# EAGLE schematic carrier (EAGLE 6.1)
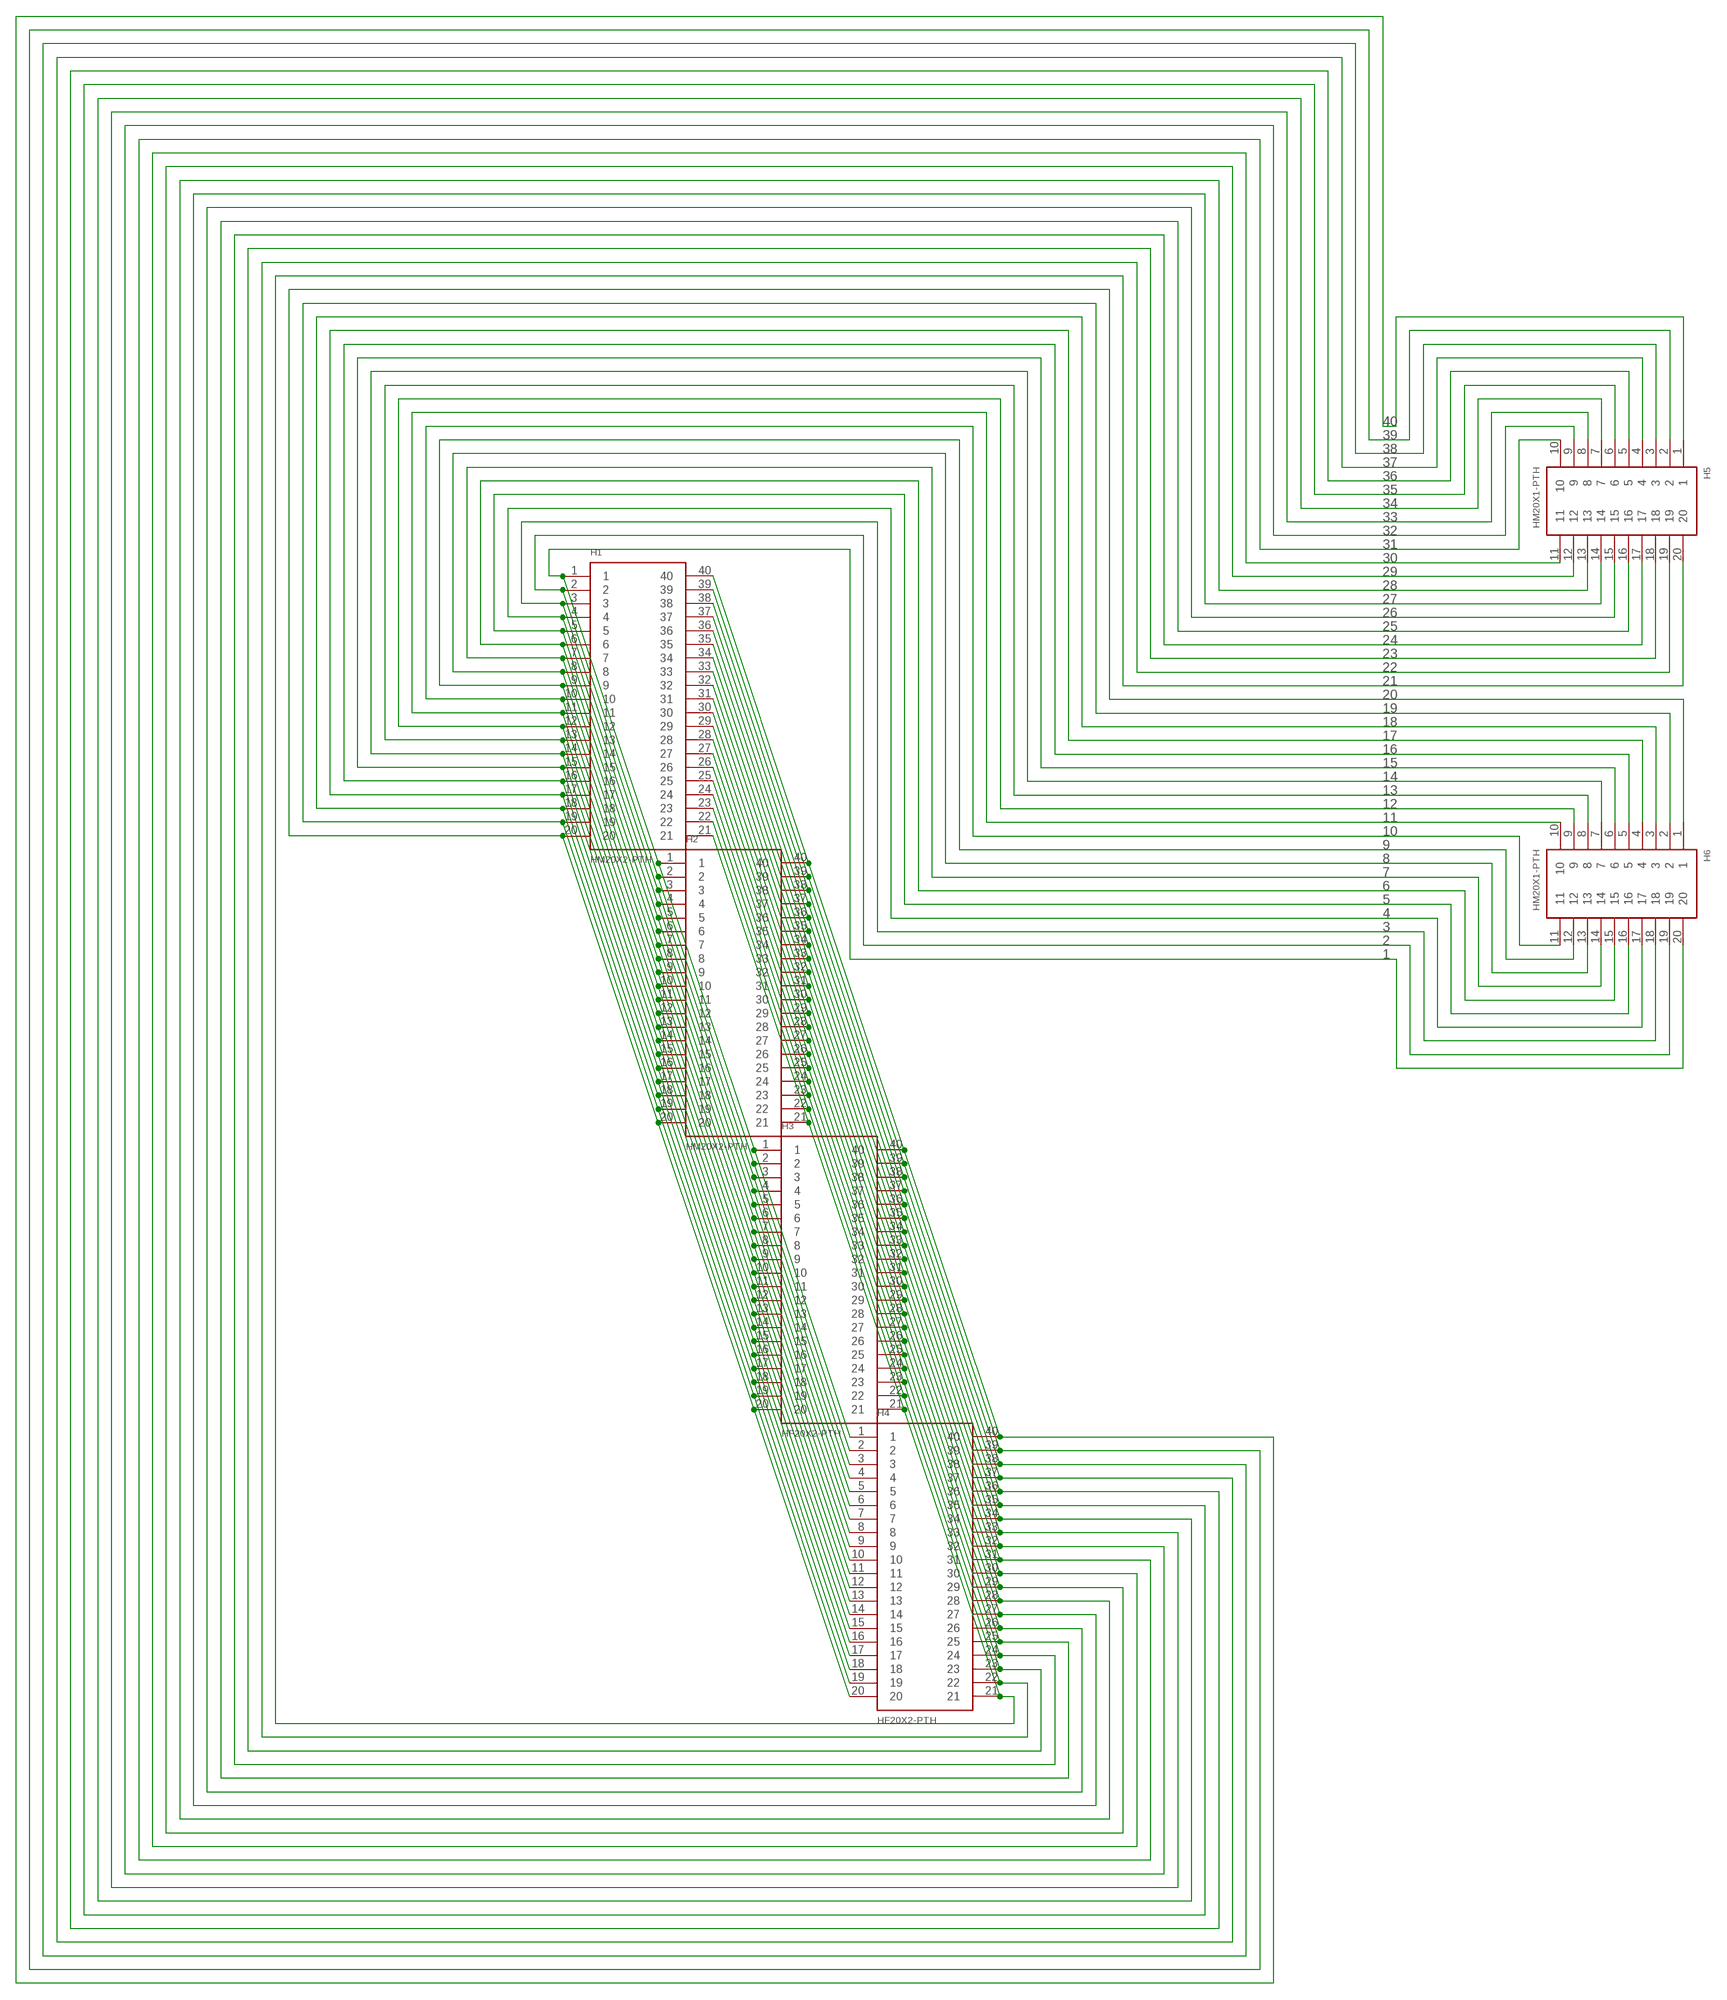
[diagram p0: schematic, sheet 1]

## Parts
H1  HM20X2-PTH  [HM20X2-PTH]
H2  HM20X2-PTH  [HM20X2-PTH]
H3  HF20X2-PTH  [HF20X2-PTH]
H4  HF20X2-PTH  [HF20X2-PTH]
H5  HM20X1-PTH  [HM20X1-PTH]
H6  HM20X1-PTH  [HM20X1-PTH]

## Nets
1: H1.1 H2.1 H3.1 H4.1 H6.20
2: H1.2 H2.2 H3.2 H4.2 H6.19
3: H1.3 H2.3 H3.3 H4.3 H6.18
4: H1.4 H2.4 H3.4 H4.4 H6.17
5: H1.5 H2.5 H3.5 H4.5 H6.16
6: H1.6 H2.6 H3.6 H4.6 H6.15
7: H1.7 H2.7 H3.7 H4.7 H6.14
8: H1.8 H2.8 H3.8 H4.8 H6.13
9: H1.9 H2.9 H3.9 H4.9 H6.12
10: H1.10 H2.10 H3.10 H4.10 H6.11
11: H1.11 H2.11 H3.11 H4.11 H6.10
12: H1.12 H2.12 H3.12 H4.12 H6.9
13: H1.13 H2.13 H3.13 H4.13 H6.8
14: H1.14 H2.14 H3.14 H4.14 H6.7
15: H1.15 H2.15 H3.15 H4.15 H6.6
16: H1.16 H2.16 H3.16 H4.16 H6.5
17: H1.17 H2.17 H3.17 H4.17 H6.4
18: H1.18 H2.18 H3.18 H4.18 H6.3
19: H1.19 H2.19 H3.19 H4.19 H6.2
20: H1.20 H2.20 H3.20 H4.20 H6.1
21: H1.21 H2.21 H3.21 H4.21 H5.20
22: H1.22 H2.22 H3.22 H4.22 H5.19
23: H1.23 H2.23 H3.23 H4.23 H5.18
24: H1.24 H2.24 H3.24 H4.24 H5.17
25: H1.25 H2.25 H3.25 H4.25 H5.16
26: H1.26 H2.26 H3.26 H4.26 H5.15
27: H1.27 H2.27 H3.27 H4.27 H5.14
28: H1.28 H2.28 H3.28 H4.28 H5.13
29: H1.29 H2.29 H3.29 H4.29 H5.12
30: H1.30 H2.30 H3.30 H4.30 H5.11
31: H1.31 H2.31 H3.31 H4.31 H5.10
32: H1.32 H2.32 H3.32 H4.32 H5.9
33: H1.33 H2.33 H3.33 H4.33 H5.8
34: H1.34 H2.34 H3.34 H4.34 H5.7
35: H1.35 H2.35 H3.35 H4.35 H5.6
36: H1.36 H2.36 H3.36 H4.36 H5.5
37: H1.37 H2.37 H3.37 H4.37 H5.4
38: H1.38 H2.38 H3.38 H4.38 H5.3
39: H1.39 H2.39 H3.39 H4.39 H5.2
40: H1.40 H2.40 H3.40 H4.40 H5.1

## Library data of the parts
H1 H2 = august24:HM20X2
H3 H4 = august24:HF20X2
H5 H6 = august24:HM20X1